# Altium schematic sheet PIO.SchDoc
size A
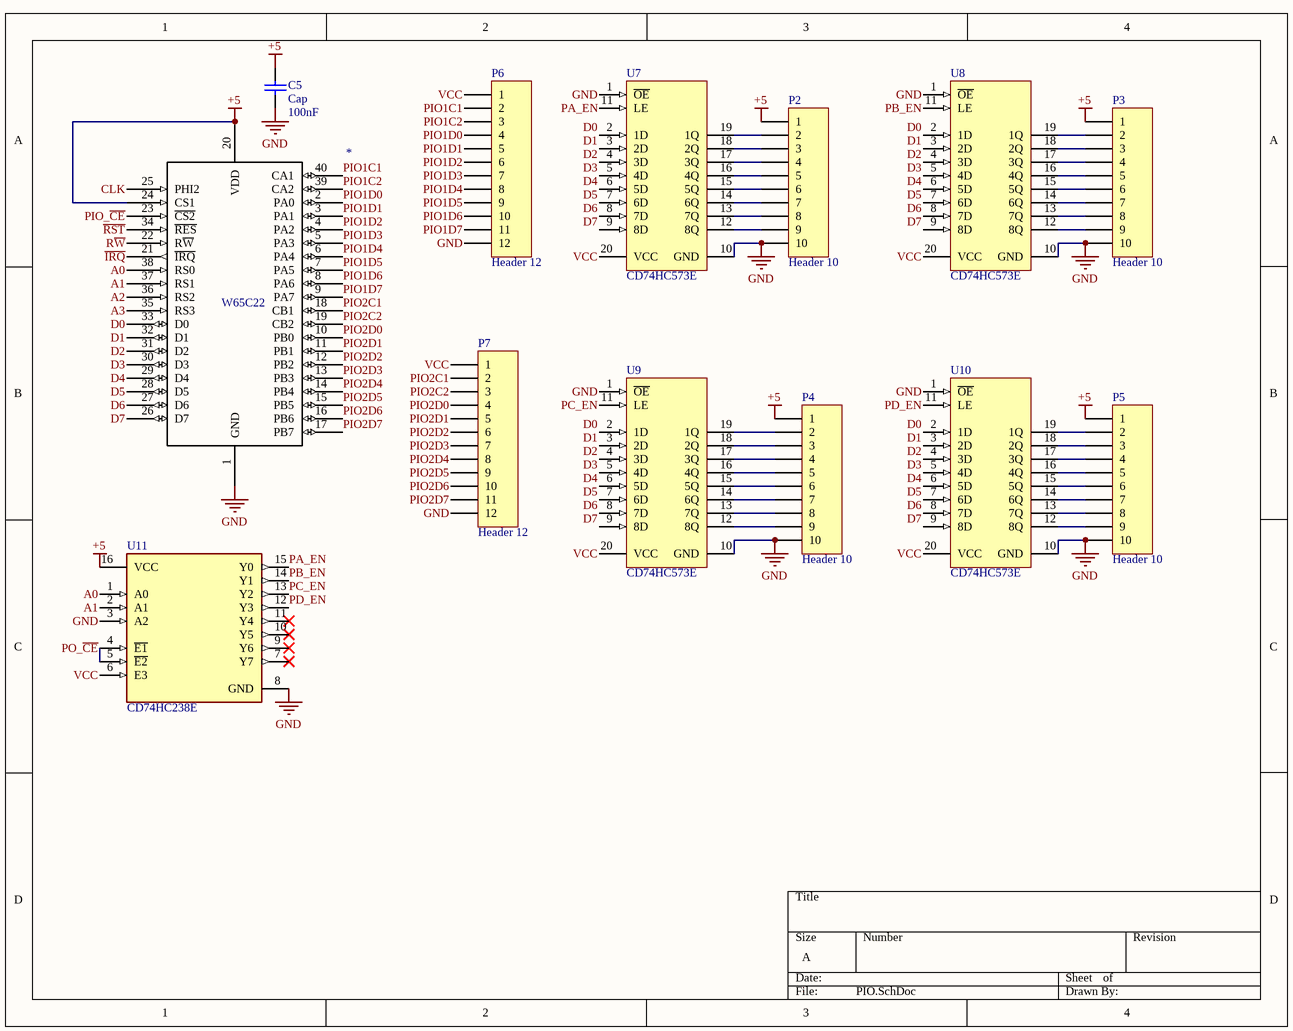
[diagram p0: PIO.SchDoc]

## Parts
*  W65C22  [DIP40]
C5  Cap  value 100nF  [Ceramic Capacitor]
P2  Header 10  [HDR1X10]
P3  Header 10  [HDR1X10]
P4  Header 10  [HDR1X10]
P5  Header 10  [HDR1X10]
P6  Header 12  [HDR1X12]
P7  Header 12  [HDR1X12]
U7  CD74HC573E  [N0020A]
U8  CD74HC573E  [N0020A]
U9  CD74HC573E  [N0020A]
U10  CD74HC573E  [N0020A]
U11  CD74HC238E  [FP-N0016A-MFG]

## Nets
+5: *.20(VDD) *.24(CS1) C5.1 P2.1 P3.1 P4.1 P5.1 U11.16(VCC)
GND: *.1(GND) C5.2 P2.10 P3.10 P4.10 P5.10 P6.12 P7.12 U7.1(~{OE}) U7.10(GND) U8.1(~{OE}) U8.10(GND) U9.1(~{OE}) U9.10(GND) U10.1(~{OE}) U10.10(GND) U11.3(A2) U11.8(GND)
A0: *.38(RS0) U11.1(A0)
A1: *.37(RS1) U11.2(A1)
A2: *.36(RS2)
A3: *.35(RS3)
CLK: *.25(PHI2)
D0: *.33(D0) U7.2(1D) U8.2(1D) U9.2(1D) U10.2(1D)
D1: *.32(D1) U7.3(2D) U8.3(2D) U9.3(2D) U10.3(2D)
D2: *.31(D2) U7.4(3D) U8.4(3D) U9.4(3D) U10.4(3D)
D3: *.30(D3) U7.5(4D) U8.5(4D) U9.5(4D) U10.5(4D)
D4: *.29(D4) U7.6(5D) U8.6(5D) U9.6(5D) U10.6(5D)
D5: *.28(D5) U7.7(6D) U8.7(6D) U9.7(6D) U10.7(6D)
D6: *.27(D6) U7.8(7D) U8.8(7D) U9.8(7D) U10.8(7D)
D7: *.26(D7) U7.9(8D) U8.9(8D) U9.9(8D) U10.9(8D)
~{IRQ}: *.21(~{IRQ})
PA_EN: U7.11(LE) U11.15(Y0)
PB_EN: U8.11(LE) U11.14(Y1)
PC_EN: U9.11(LE) U11.13(Y2)
PD_EN: U10.11(LE) U11.12(Y3)
PIO1C1: *.40(CA1) P6.2
PIO1C2: *.39(CA2) P6.3
PIO1D0: *.2(PA0) P6.4
PIO1D1: *.3(PA1) P6.5
PIO1D2: *.4(PA2) P6.6
PIO1D3: *.5(PA3) P6.7
PIO1D4: *.6(PA4) P6.8
PIO1D5: *.7(PA5) P6.9
PIO1D6: *.8(PA6) P6.10
PIO1D7: *.9(PA7) P6.11
PIO2C1: *.18(CB1) P7.2
PIO2C2: *.19(CB2) P7.3
PIO2D0: *.10(PB0) P7.4
PIO2D1: *.11(PB1) P7.5
PIO2D2: *.12(PB2) P7.6
PIO2D3: *.13(PB3) P7.7
PIO2D4: *.14(PB4) P7.8
PIO2D5: *.15(PB5) P7.9
PIO2D6: *.16(PB6) P7.10
PIO2D7: *.17(PB7) P7.11
PIO_~{CE}: *.23(~{CS2})
PO_~{CE}: U11.4(~{E1}) U11.5(~{E2})
~{RST}: *.34(~{RES})
R~{W}: *.22(R~{W})
VCC: P6.1 P7.1 U7.20(VCC) U8.20(VCC) U9.20(VCC) U10.20(VCC) U11.6(E3)
NetP2_2: P2.2 U7.19(1Q)
NetP2_3: P2.3 U7.18(2Q)
NetP2_4: P2.4 U7.17(3Q)
NetP2_5: P2.5 U7.16(4Q)
NetP2_6: P2.6 U7.15(5Q)
NetP2_7: P2.7 U7.14(6Q)
NetP2_8: P2.8 U7.13(7Q)
NetP2_9: P2.9 U7.12(8Q)
NetP3_2: P3.2 U8.19(1Q)
NetP3_3: P3.3 U8.18(2Q)
NetP3_4: P3.4 U8.17(3Q)
NetP3_5: P3.5 U8.16(4Q)
NetP3_6: P3.6 U8.15(5Q)
NetP3_7: P3.7 U8.14(6Q)
NetP3_8: P3.8 U8.13(7Q)
NetP3_9: P3.9 U8.12(8Q)
NetP4_2: P4.2 U9.19(1Q)
NetP4_3: P4.3 U9.18(2Q)
NetP4_4: P4.4 U9.17(3Q)
NetP4_5: P4.5 U9.16(4Q)
NetP4_6: P4.6 U9.15(5Q)
NetP4_7: P4.7 U9.14(6Q)
NetP4_8: P4.8 U9.13(7Q)
NetP4_9: P4.9 U9.12(8Q)
NetP5_2: P5.2 U10.19(1Q)
NetP5_3: P5.3 U10.18(2Q)
NetP5_4: P5.4 U10.17(3Q)
NetP5_5: P5.5 U10.16(4Q)
NetP5_6: P5.6 U10.15(5Q)
NetP5_7: P5.7 U10.14(6Q)
NetP5_8: P5.8 U10.13(7Q)
NetP5_9: P5.9 U10.12(8Q)

Not connected (* = marked no-connect by the designer): U11 7(Y7)* 9(Y6)* 10(Y5)* 11(Y4)*

## Library data of the parts
C5 = Cap: Capacitor; Published: 8-Jun-2000; LatestRevisionDate: 17-Jul-2002; LatestRevisionNote: Re-released for DXP Platform.; PackageReference: RAD-0.3; Publisher: Altium Limited; PackageDescription: Radial Cap, Thru-Hole; 2 Leads; 0.3 in Pin Spacing
P2-P5 = Header 10: Header, 10-Pin; LatestRevisionDate: 17-Jul-2002; LatestRevisionNote: Re-released for DXP Platform.; Publisher: Altium Limited
P6 P7 = Header 12: Header, 12-Pin; LatestRevisionDate: 17-Jul-2002; LatestRevisionNote: Re-released for DXP Platform.; Publisher: Altium Limited
U7-U10 = CMP-1621-00360-2: High Speed CMOS Logic Octal Transparent Latches with 3-State Outputs, N0020A, TUBE; Manufacturer: Texas Instruments; Output Drive (IOL/IOH)(Max)(mA): 7.8/-7.8; Schmitt Trigger: No; Bits(#): 8; Technology Family: HC; Output Logic: Inverted; Voltage(Nom)(V): 6; tpd @ Nom Voltage(Max)(ns): 37; 3-State Output: Yes; ICC @ Nom Voltage(Max)(mA): 0.08; F @ Nom Voltage(Max)(Mhz): 28; Rating: Catalog; VCC(Min)(V): 2; Generic Part Number: CD74HC573; PackageReference: N0020A; Input Type: CMOS; DatasheetVersion: SCLS454A; VCC(Max)(V): 6; Output Type: CMOS; Code_JEDEC: MS-001; Operating Temperature Range(C): -55 to 125
U11 = CMP-1633-00674-3: IC DECODER/DEMUX 1X3:8 16DIP; Low Level Output Current: 5.2mA; Number of Inputs: 3; Number of Bits: 8; High Level Output Current: -5.2mA; Turn-On Delay Time: 265ns; Bandwidth: 28MHz; Number of Channels: 1; Polarity: Non-Inverting; Quiescent Current: 8uA; Propagation Delay: 13ns; Supply Type: Single; Logic Function: Demultiplexer; Min Supply Voltage: 2V; Max Supply Voltage: 6V; Packaging: Rail/Tube; Number of Pins: 16; Number of Input Lines: 3; RoHS Compliant: Yes; Mount: Through Hole; Max Operating Temperature: 125°C; Package Quantity: 25; Number of Elements: 1; Min Operating Temperature: -55°C; Number of Outputs: 8; Contact Plating: Gold; Lead Free: Lead Free; Independent Circuits: 1; Number of Output Lines: 8; Weight: 0.03357oz; Case/Package: PDIP; Radiation Hardening: No; REACH SVHC: No SVHC